# Altium schematic sheet board_ports.SchDoc
size A3
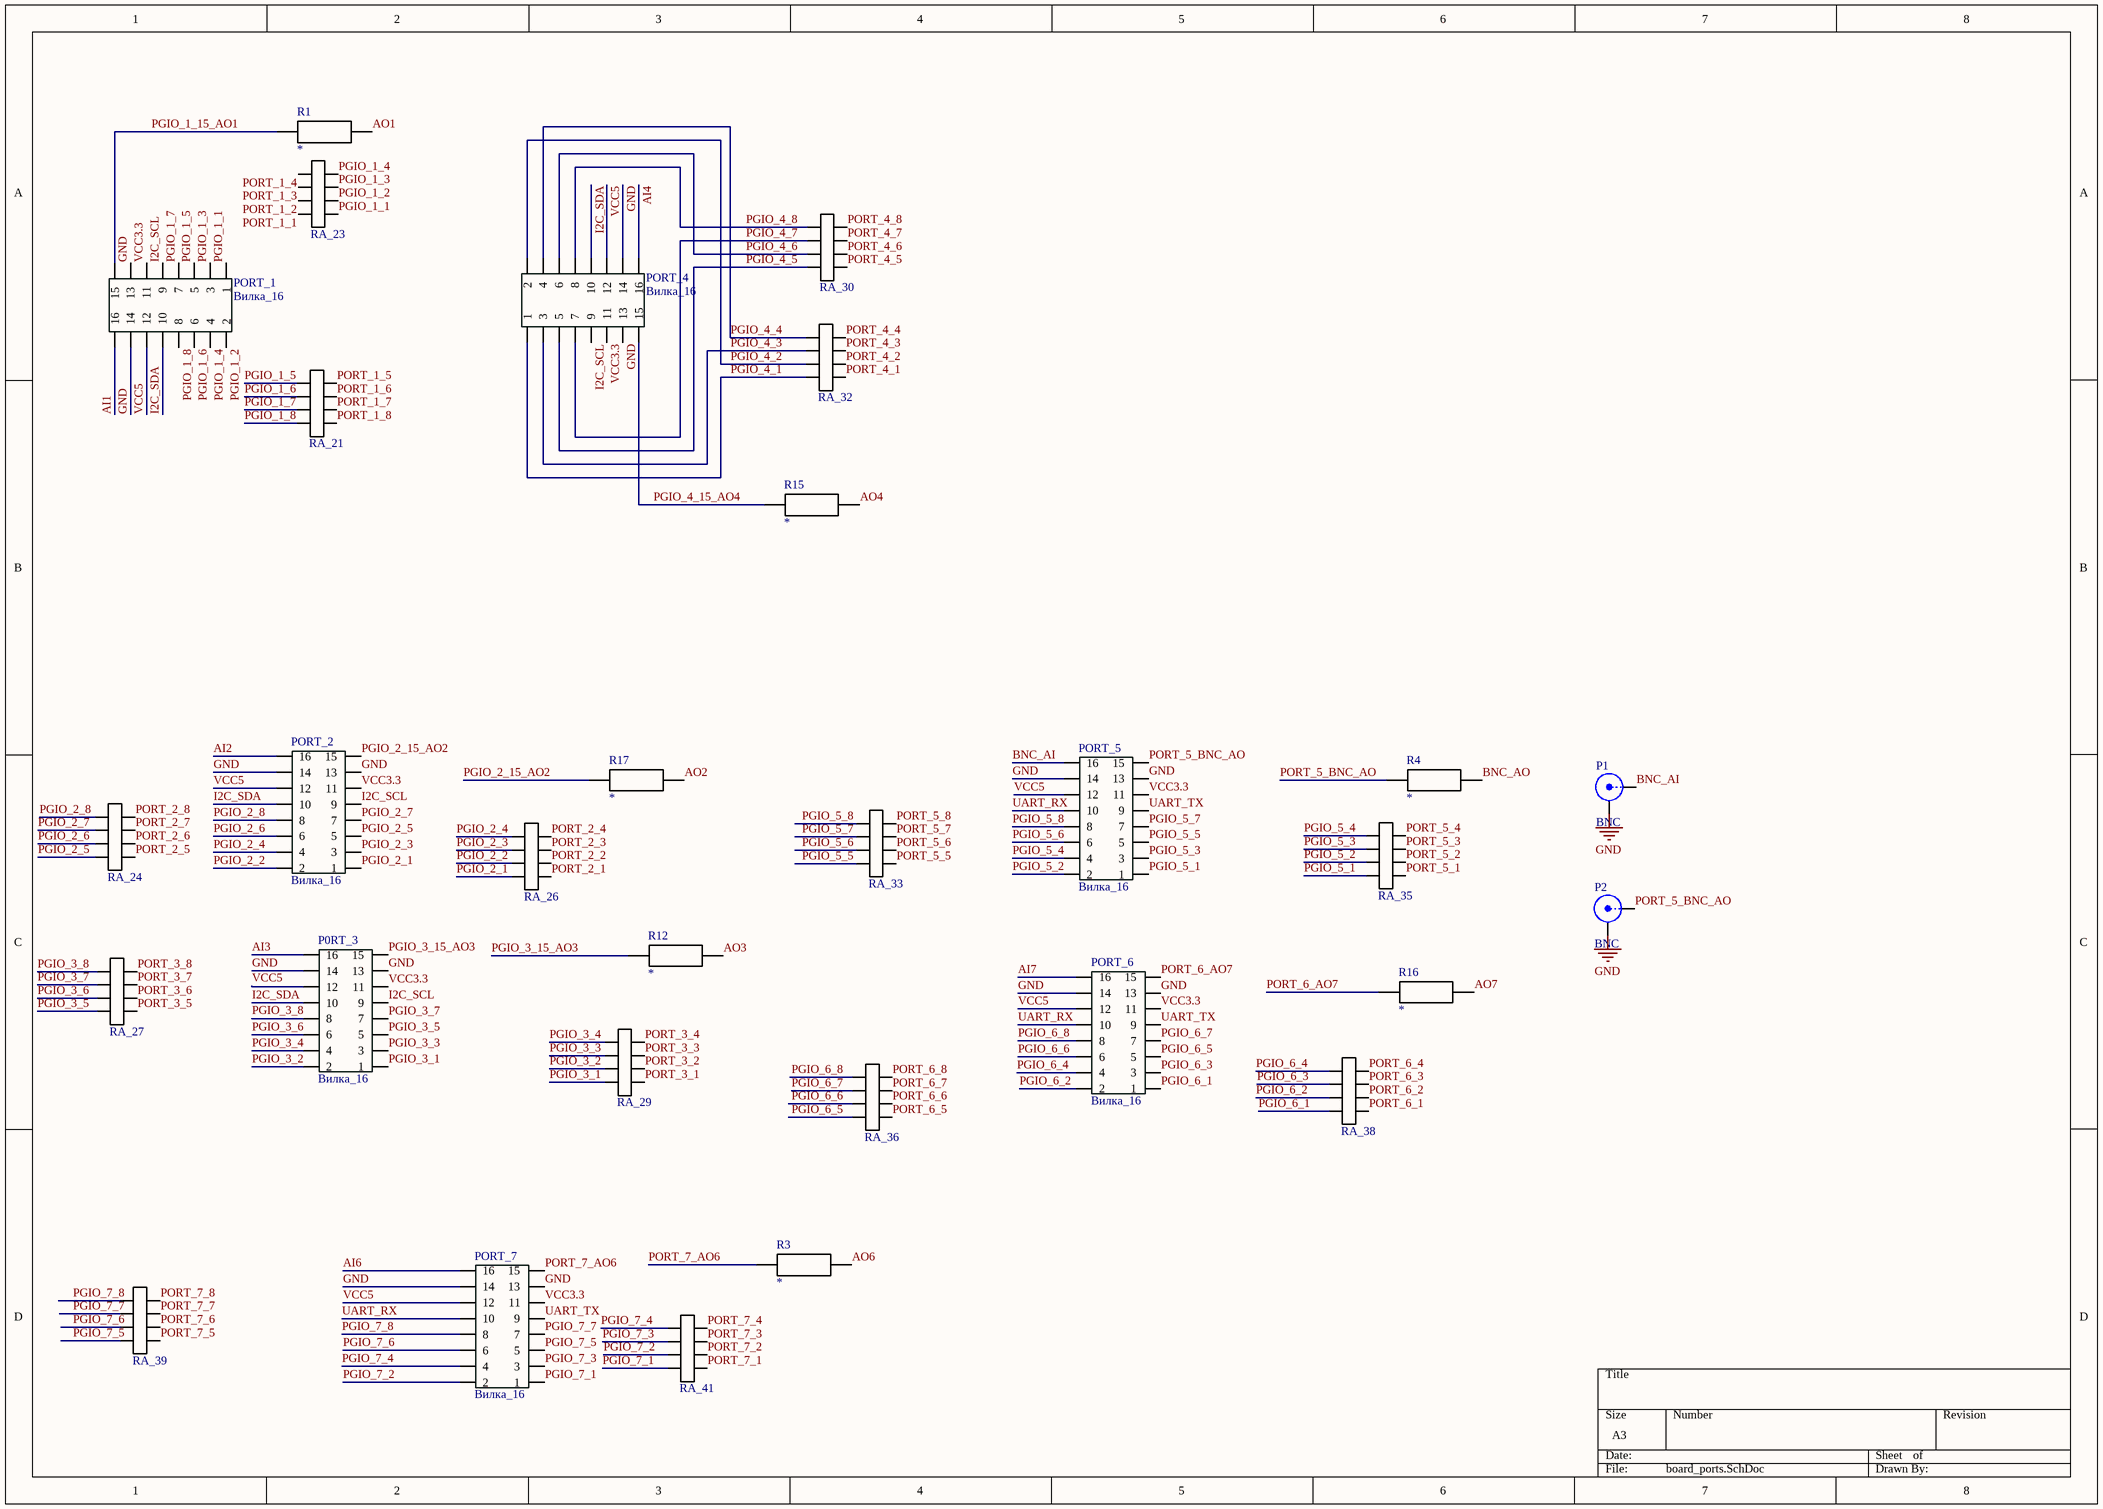
[diagram p0: board_ports.SchDoc]

## Parts
P0RT_3  Вилка_16  [DS1013-16]
P1  BNC  [BNC_RA CON]
P2  BNC  [BNC_RA CON]
PORT_1  Вилка_16  [DS1013-16]
PORT_2  Вилка_16  [DS1013-16]
PORT_4  Вилка_16  [DS1013-16]
PORT_5  Вилка_16  [DS1013-16]
PORT_6  Вилка_16  [DS1013-16]
PORT_7  Вилка_16  [DS1013-16]
R1  *  [R0805]
R3  *  [R0805]
R4  *  [R0805]
R12  *  [R0805]
R15  *  [R0805]
R16  *  [R0805]
R17  *  [R0805]
RA_21  Bourns CAT16-102J4LF_1  [CAT16-102J4_NEW]  (value not drawn)
RA_23  Bourns CAT16-102J4LF_1  [CAT16-102J4_NEW]  (value not drawn)
RA_24  Bourns CAT16-102J4LF_1  [CAT16-102J4_NEW]  (value not drawn)
RA_26  Bourns CAT16-102J4LF_1  [CAT16-102J4_NEW]  (value not drawn)
RA_27  Bourns CAT16-102J4LF_1  [CAT16-102J4_NEW]  (value not drawn)
RA_29  Bourns CAT16-102J4LF_1  [CAT16-102J4_NEW]  (value not drawn)
RA_30  Bourns CAT16-102J4LF_1  [CAT16-102J4_NEW]  (value not drawn)
RA_32  Bourns CAT16-102J4LF_1  [CAT16-102J4_NEW]  (value not drawn)
RA_33  Bourns CAT16-102J4LF_1  [CAT16-102J4_NEW]  (value not drawn)
RA_35  Bourns CAT16-102J4LF_1  [CAT16-102J4_NEW]  (value not drawn)
RA_36  Bourns CAT16-102J4LF_1  [CAT16-102J4_NEW]  (value not drawn)
RA_38  Bourns CAT16-102J4LF_1  [CAT16-102J4_NEW]  (value not drawn)
RA_39  Bourns CAT16-102J4LF_1  [CAT16-102J4_NEW]  (value not drawn)
RA_41  Bourns CAT16-102J4LF_1  [CAT16-102J4_NEW]  (value not drawn)

## Nets
GND: P0RT_3.13 P0RT_3.14 P1.2(Y) P2.2(Y) PORT_1.13 PORT_1.14 PORT_2.13 PORT_2.14 PORT_4.13 PORT_4.14 PORT_5.13 PORT_5.14 PORT_6.13 PORT_6.14 PORT_7.13 PORT_7.14
AI1: PORT_1.16
AI2: PORT_2.16
AI3: P0RT_3.16
AI4: PORT_4.16
AI6: PORT_7.16
AI7: PORT_6.16
AO1: R1.2
AO2: R17.2
AO3: R12.2
AO4: R15.2
AO6: R3.2
AO7: R16.2
BNC_AI: P1.1(X) PORT_5.16
BNC_AO: R4.2
I2C_SCL: P0RT_3.9 PORT_1.9 PORT_2.9 PORT_4.9
I2C_SDA: P0RT_3.10 PORT_1.10 PORT_2.10 PORT_4.10
PGIO_1_1: PORT_1.1 RA_23.7
PGIO_1_2: PORT_1.2 RA_23.6
PGIO_1_3: PORT_1.3 RA_23.5
PGIO_1_4: PORT_1.4 RA_23.4
PGIO_1_5: PORT_1.5 RA_21.3
PGIO_1_6: PORT_1.6 RA_21.2
PGIO_1_7: PORT_1.7 RA_21.1
PGIO_1_8: PORT_1.8 RA_21.0
PGIO_1_15_AO1: PORT_1.15 R1.1
PGIO_2_1: PORT_2.1 RA_26.4
PGIO_2_2: PORT_2.2 RA_26.5
PGIO_2_3: PORT_2.3 RA_26.6
PGIO_2_4: PORT_2.4 RA_26.7
PGIO_2_5: PORT_2.5 RA_24.0
PGIO_2_6: PORT_2.6 RA_24.1
PGIO_2_7: PORT_2.7 RA_24.2
PGIO_2_8: PORT_2.8 RA_24.3
PGIO_2_15_AO2: PORT_2.15 R17.1
PGIO_3_1: P0RT_3.1 RA_29.0
PGIO_3_2: P0RT_3.2 RA_29.1
PGIO_3_3: P0RT_3.3 RA_29.2
PGIO_3_4: P0RT_3.4 RA_29.3
PGIO_3_5: P0RT_3.5 RA_27.0
PGIO_3_6: P0RT_3.6 RA_27.1
PGIO_3_7: P0RT_3.7 RA_27.2
PGIO_3_8: P0RT_3.8 RA_27.3
PGIO_3_15_AO3: P0RT_3.15 R12.1
PGIO_4_1: PORT_4.1 RA_32.4
PGIO_4_2: PORT_4.2 RA_32.5
PGIO_4_3: PORT_4.3 RA_32.6
PGIO_4_4: PORT_4.4 RA_32.7
PGIO_4_5: PORT_4.5 RA_30.4
PGIO_4_6: PORT_4.6 RA_30.5
PGIO_4_7: PORT_4.7 RA_30.6
PGIO_4_8: PORT_4.8 RA_30.7
PGIO_4_15_AO4: PORT_4.15 R15.1
PGIO_5_1: PORT_5.1 RA_35.0
PGIO_5_2: PORT_5.2 RA_35.1
PGIO_5_3: PORT_5.3 RA_35.2
PGIO_5_4: PORT_5.4 RA_35.3
PGIO_5_5: PORT_5.5 RA_33.0
PGIO_5_6: PORT_5.6 RA_33.1
PGIO_5_7: PORT_5.7 RA_33.2
PGIO_5_8: PORT_5.8 RA_33.3
PGIO_6_1: PORT_6.1 RA_38.4
PGIO_6_2: PORT_6.2 RA_38.5
PGIO_6_3: PORT_6.3 RA_38.6
PGIO_6_4: PORT_6.4 RA_38.7
PGIO_6_5: PORT_6.5 RA_36.0
PGIO_6_6: PORT_6.6 RA_36.1
PGIO_6_7: PORT_6.7 RA_36.2
PGIO_6_8: PORT_6.8 RA_36.3
PGIO_7_1: PORT_7.1 RA_41.4
PGIO_7_2: PORT_7.2 RA_41.5
PGIO_7_3: PORT_7.3 RA_41.6
PGIO_7_4: PORT_7.4 RA_41.7
PGIO_7_5: PORT_7.5 RA_39.0
PGIO_7_6: PORT_7.6 RA_39.1
PGIO_7_7: PORT_7.7 RA_39.2
PGIO_7_8: PORT_7.8 RA_39.3
PORT_1_1: RA_23.0
PORT_1_2: RA_23.1
PORT_1_3: RA_23.2
PORT_1_4: RA_23.3
PORT_1_5: RA_21.4
PORT_1_6: RA_21.5
PORT_1_7: RA_21.6
PORT_1_8: RA_21.7
PORT_2_1: RA_26.3
PORT_2_2: RA_26.2
PORT_2_3: RA_26.1
PORT_2_4: RA_26.0
PORT_2_5: RA_24.7
PORT_2_6: RA_24.6
PORT_2_7: RA_24.5
PORT_2_8: RA_24.4
PORT_3_1: RA_29.7
PORT_3_2: RA_29.6
PORT_3_3: RA_29.5
PORT_3_4: RA_29.4
PORT_3_5: RA_27.7
PORT_3_6: RA_27.6
PORT_3_7: RA_27.5
PORT_3_8: RA_27.4
PORT_4_1: RA_32.3
PORT_4_2: RA_32.2
PORT_4_3: RA_32.1
PORT_4_4: RA_32.0
PORT_4_5: RA_30.3
PORT_4_6: RA_30.2
PORT_4_7: RA_30.1
PORT_4_8: RA_30.0
PORT_5_1: RA_35.7
PORT_5_2: RA_35.6
PORT_5_3: RA_35.5
PORT_5_4: RA_35.4
PORT_5_5: RA_33.7
PORT_5_6: RA_33.6
PORT_5_7: RA_33.5
PORT_5_8: RA_33.4
PORT_5_BNC_AO: P2.1(X) PORT_5.15 R4.1
PORT_6_1: RA_38.3
PORT_6_2: RA_38.2
PORT_6_3: RA_38.1
PORT_6_4: RA_38.0
PORT_6_5: RA_36.7
PORT_6_6: RA_36.6
PORT_6_7: RA_36.5
PORT_6_8: RA_36.4
PORT_6_AO7: PORT_6.15 R16.1
PORT_7_1: RA_41.3
PORT_7_2: RA_41.2
PORT_7_3: RA_41.1
PORT_7_4: RA_41.0
PORT_7_5: RA_39.7
PORT_7_6: RA_39.6
PORT_7_7: RA_39.5
PORT_7_8: RA_39.4
PORT_7_AO6: PORT_7.15 R3.1
UART_RX: PORT_5.10 PORT_6.10 PORT_7.10
UART_TX: PORT_5.9 PORT_6.9 PORT_7.9
VCC3.3: P0RT_3.11 PORT_1.11 PORT_2.11 PORT_4.11 PORT_5.11 PORT_6.11 PORT_7.11
VCC5: P0RT_3.12 PORT_1.12 PORT_2.12 PORT_4.12 PORT_5.12 PORT_6.12 PORT_7.12

## Library data of the parts
P0RT_3 PORT_1 PORT_2 PORT_4-PORT_7 = DS1013-16: 16_pin
P1 P2 = BNC: BNC Elbow Connector; LatestRevisionDate: 17-Jul-2002; LatestRevisionNote: Re-released for DXP Platform.; Publisher: Altium Limited
R1 R3 R4 R12 R15-R17 = R0805: Resistance: *